# Altium schematic sheet Power.SchDoc
size A4; SheetNumber: 3; SheetTotal: 5
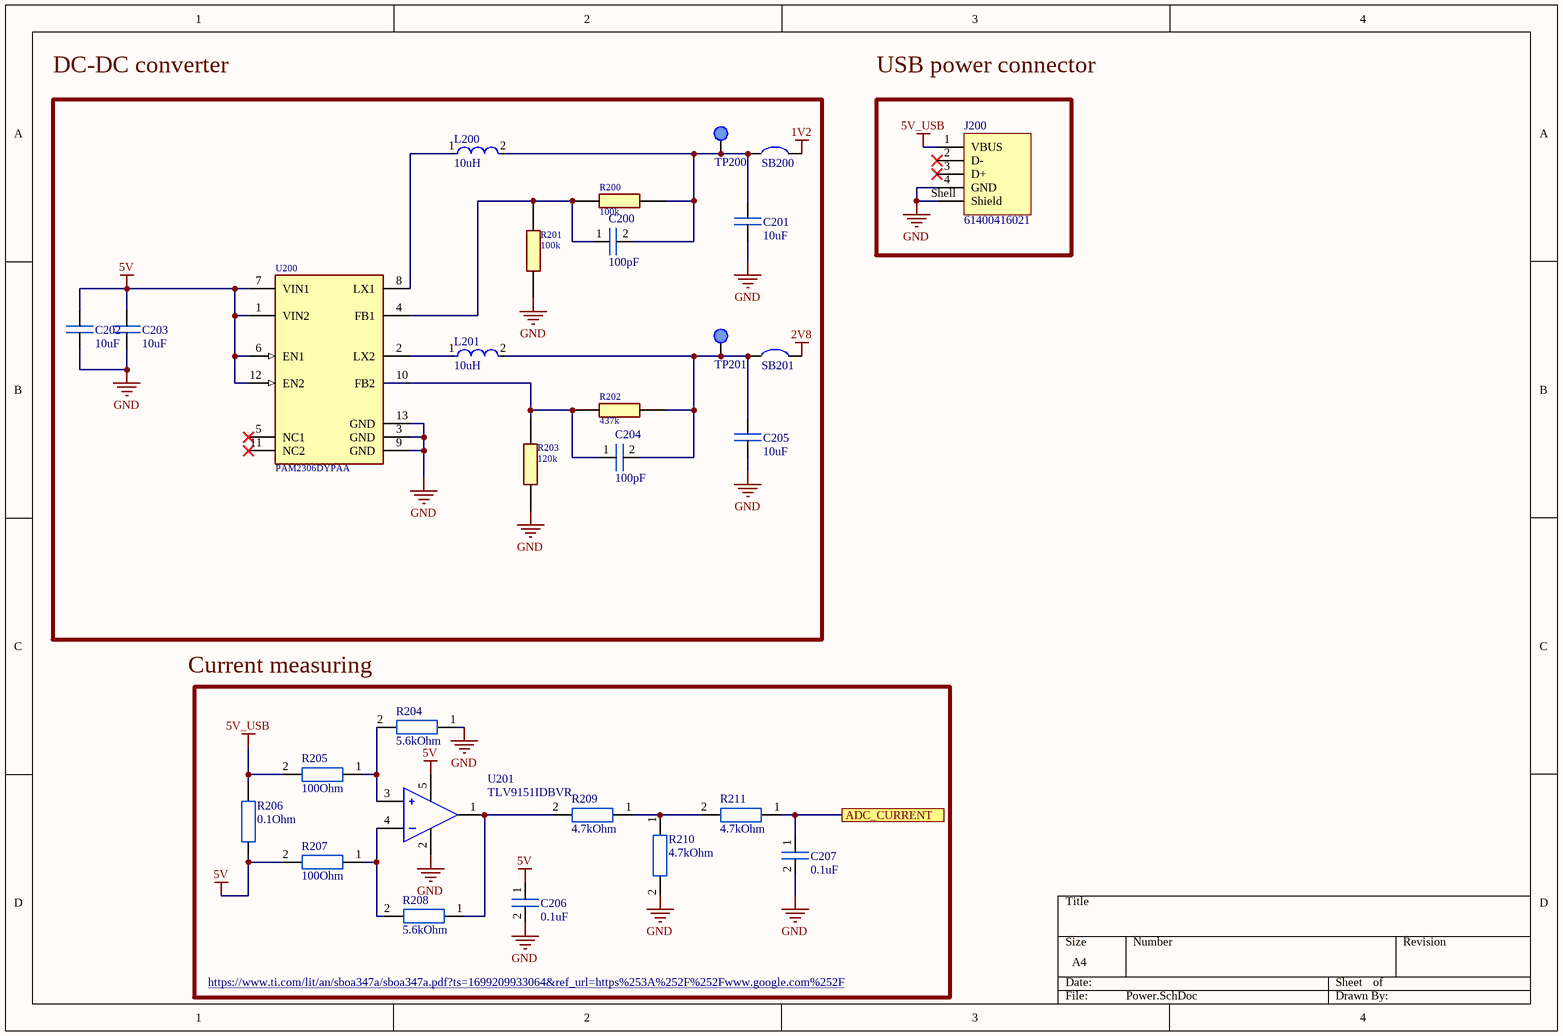
[diagram p0: Power.SchDoc]

## Parts
C200  100pF  [0402_footprint]
C201  10uF  [0805_FOOTPRINT]
C202  10uF  [0805_FOOTPRINT]
C203  10uF  [0805_FOOTPRINT]
C204  100pF  [0402_footprint]
C205  10uF  [0805_FOOTPRINT]
C206  0.1uF  [0402_footprint]
C207  0.1uF  [0402_footprint]
J200  61400416021  [61400416021]
L200  10uH  [FP-NR5040-H_4_1-MFG]
L201  10uH  [FP-NR5040-H_4_1-MFG]
R200  100k  [0805]
R201  100k  [0805]
R202  437k  [0805]
R203  120k  [0805]
R204  5.6kOhm  [0402_footprint]
R205  100Ohm  [0402_footprint]
R206  0.1Ohm  [0805_FOOTPRINT]
R207  100Ohm  [0402_footprint]
R208  5.6kOhm  [0402_footprint]
R209  4.7kOhm  [0402_footprint]
R210  4.7kOhm  [0402_footprint]
R211  4.7kOhm  [0402_footprint]
SB200  Solder_bridge  [SOLDER_BRIDGE]  (value not drawn)
SB201  Solder_bridge  [SOLDER_BRIDGE]  (value not drawn)
TP200  Test_point  [TEST_POINT]  (value not drawn)
TP201  Test_point  [TEST_POINT]  (value not drawn)
U200  PAM2306DYPAA  [DCDC]
U201  TLV9151IDBVR  [FP-DBV0005A-IPC_A]

## Ports
ADC_CURRENT

## Nets
1V2: SB200.2
2V8: SB201.2
5V: C202.2 C203.2 C206.1 R206.1 R207.2 U200.1(VIN2) U200.6(EN1) U200.7(VIN1) U200.12(EN2) U201.5(V+)
5V_USB: J200.1(VBUS) R205.2 R206.2
GND: C201.1 C202.1 C203.1 C205.1 C206.2 C207.2 J200.4(GND) J200.Shell(Shield) R201.2 R203.1 R204.1 R210.2 U200.3(GND) U200.9(GND) U200.13(GND) U201.2(V-)
ADC_CURRENT: C207.1 R211.1 ; port ADC_CURRENT
NetC200_1: C200.1 R200.1 R201.1 U200.4(FB1)
NetC200_2: C200.2 C201.2 L200.2 R200.2 SB200.1 TP200.1
NetC204_1: C204.1 R202.2 R203.2 U200.10(FB2)
NetC204_2: C204.2 C205.2 L201.2 R202.1 SB201.1 TP201.1
NetL200_1: L200.1 U200.8(LX1)
NetL201_1: L201.1 U200.2(LX2)
NetR204_2: R204.2 R205.1 U201.3(IN+)
NetR207_1: R207.1 R208.2 U201.4(IN-)
NetR208_1: R208.1 R209.2 U201.1(OUT)
NetR209_1: R209.1 R210.1 R211.2

Not connected (* = marked no-connect by the designer): J200 2(D-)* 3(D+)*; U200 5(NC1)* 11(NC2)*

## Notes on the sheet
- DC-DC converter
- USB power connector
- (near R204) Current measuring
- https://www.ti.com/lit/an/sboa347a/sboa347a.pdf?ts=1699209933064&ref_url=https%253A%252F%252Fwww.google.com%252F

## Library data of the parts
C200 C204 C206 C207 = Capacitor_0402: 0402 capacitor
  C200 C204: ComponentLink1Description: Buy; ComponentLink1URL: https://www.mouser.lt/ProductDetail/TAIYO-YUDEN/MAASL063SB7101MFCA01?qs=tlsG%2FOw5FFiYJqKsbt67cA%3D%3D
C201-C203 C205 = Capacitor_0805: ComponentLink1Description: Buy; ComponentLink1URL: https://www.mouser.lt/ProductDetail/963-MSASL21GAB7106KT
J200 = CMP-1502-03227-2: NexarPartId: 21041530; Contact Resistance: 20mΩ; Gender: Receptacle; Voltage Rating (DC): 30V; Current Rating: 1.5A; Connector Type: USB; Insulation Resistance: 1GΩ; USB Standard: USB 2.0; Number of Contacts: 4; Number of Ports: 1; Width: 14.4mm; REACH SVHC: Unknown; Contact Plating: Gold; Length: 15.8mm; Lead Free: Lead Free; Max Operating Temperature: 105°C; Orientation: Horizontal; Contact Material: Copper; Voltage Rating: 30V; Min Operating Temperature: -40°C; Flammability Rating: UL94 V-0; Color: White; RoHS: Compliant; Number of Pins: 4; Mount: Horizontal, Through Hole; Number of Positions: 4; Operating Supply Voltage: 30V; Insulation Material: PBT; Termination: Solder; ComponentLink1Description: Buy; ComponentLink1URL: https://www.mouser.lt/ProductDetail/Amphenol-Commercial-Products/UE27AC5410H?qs=JOekRM69xWp%2FpXBIdMB8qQ%3D%3D
L200 L201 = CMP-14484-000589-1: SMD Power Inductors 10uH ±20% 2.1A 72.8mΩ
  L201: ComponentLink1Description: Buy; ComponentLink1URL: https://www.mouser.lt/ProductDetail/TAIYO-YUDEN/NRS5040T100MMGJ?qs=y6ZabgHbY%252BxiJJH9TpkLFQ%3D%3D&fbclid=IwAR06tw8zc_F3vS_tc6rGp3H4m7RLkaTrMlQiQ_PAa6jySuKYRkC0jCwxpBU
R200 = R
R201 = R: https://www.mouser.lt/ProductDetail/Panasonic/ERA-6VEB1003V?qs=rI7uf1IzohRHGRtRVKRr%2FA%3D%3D
R202 = R: RN73H2ATTD4373B25
R203 = R: ERA-6AEB124V
R204 R205 R207-R211 = Resistor_0402: 0402 resistor
R206 = Resistor_0805
U200 = PAM2306DYPAA: https://eu.mouser.com/ProductDetail/Diodes-Incorporated/PAM2306DYPAA?qs=%252BSlWJf1dfkJt9LGsP0OSAw%3D%3D&_gl=1*1y46ajh*_ga*MTcxMTg1MDAyNS4xNjk0MzU1NzEw*_ga_15W4STQT4T*MTY5ODI1ODI3MC4xNS4xLjE2OTgyNTgyNzAuNjAuMC4w; ComponentLink1Description: Datasheet; ComponentLink1URL: https://eu.mouser.com/datasheet/2/115/DIOD_S_A0010934527_1-2513103.pdf; ComponentLink2Description: Buy; ComponentLink2URL: https://www.mouser.lt/ProductDetail/Diodes-Incorporated/PAM2306DYPAA?qs=%252BSlWJf1dfkJt9LGsP0OSAw%3D%3D
U201 = CMP-04895-000336-1: OPAMP; ComponentLink1Description: Buy; ComponentLink1URL: https://www.mouser.lt/ProductDetail/Texas-Instruments/TLV9151SIDBVR?qs=bAKSY%2FctAC5JlrvQZokK1A%3D%3D; ComponentLink2Description: Datasheet; ComponentLink2URL: https://www.ti.com/lit/ds/symlink/tlv9152.pdf?HQS=dis-mous-null-mousermode-dsf-pf-null-wwe&ts=1699274671183&ref_url=https%253A%252F%252Fwww.ti.com%252Fgeneral%252Fdocs%252Fsuppproductinfo.tsp%253FdistId%253D26%2526gotoUrl%253Dhttps%253A%252F%252Fwww.ti.com%252Flit%252Fgpn%252Ftlv9152